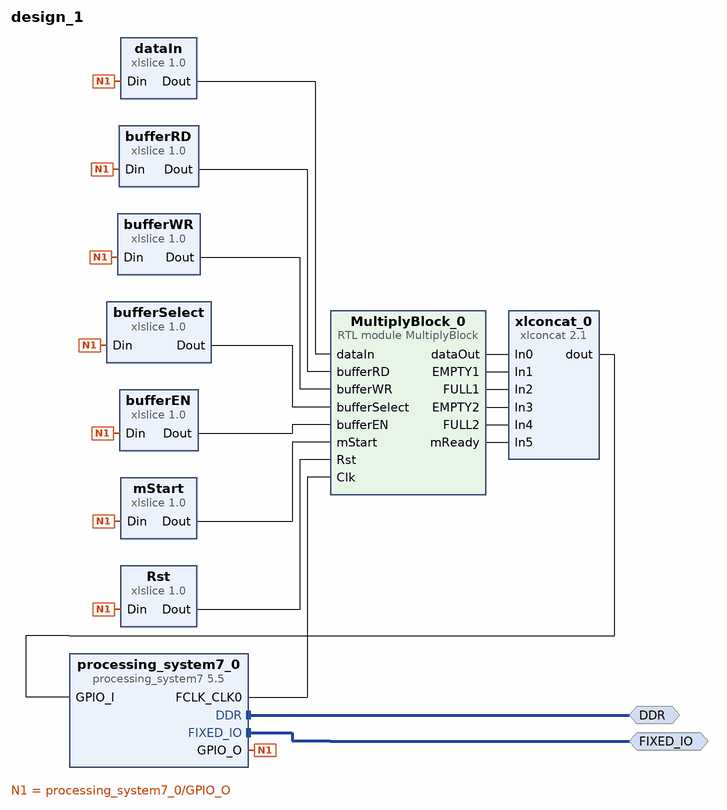
[diagram p0: block diagram of the top level]
# Vivado block design design_1, xc7z020clg400-1, Vivado 2019.2
create_bd_design design_1

create_bd_intf_port -mode Master -vlnv xilinx.com:interface:ddrx_rtl:1.0 DDR
create_bd_intf_port -mode Master -vlnv xilinx.com:display_processing_system7:fixedio_rtl:1.0 FIXED_IO

create_bd_cell -type module -reference MultiplyBlock MultiplyBlock_0
create_bd_cell -type ip -vlnv xilinx.com:ip:processing_system7:5.5 processing_system7_0
set_property -dict [list \
  CONFIG.PCW_APU_PERIPHERAL_FREQMHZ 650 \
  CONFIG.PCW_CRYSTAL_PERIPHERAL_FREQMHZ 50 \
  CONFIG.PCW_ENET0_ENET0_IO {MIO 16 .. 27} \
  CONFIG.PCW_ENET0_GRP_MDIO_ENABLE 1 \
  CONFIG.PCW_ENET0_GRP_MDIO_IO {MIO 52 .. 53} \
  CONFIG.PCW_ENET0_PERIPHERAL_ENABLE 1 \
  CONFIG.PCW_ENET0_RESET_ENABLE 1 \
  CONFIG.PCW_ENET0_RESET_IO {MIO 9} \
  CONFIG.PCW_ENET_RESET_ENABLE 1 \
  CONFIG.PCW_ENET_RESET_SELECT {Share reset pin} \
  CONFIG.PCW_FPGA0_PERIPHERAL_FREQMHZ 100 \
  CONFIG.PCW_FPGA1_PERIPHERAL_FREQMHZ 50 \
  CONFIG.PCW_GPIO_EMIO_GPIO_ENABLE 1 \
  CONFIG.PCW_GPIO_EMIO_GPIO_IO 64 \
  CONFIG.PCW_GPIO_MIO_GPIO_ENABLE 1 \
  CONFIG.PCW_GPIO_MIO_GPIO_IO MIO \
  CONFIG.PCW_I2C_RESET_ENABLE 0 \
  CONFIG.PCW_PERIPHERAL_BOARD_PRESET None \
  CONFIG.PCW_PRESET_BANK1_VOLTAGE {LVCMOS 1.8V} \
  CONFIG.PCW_QSPI_GRP_FBCLK_ENABLE 1 \
  CONFIG.PCW_QSPI_GRP_FBCLK_IO {MIO 8} \
  CONFIG.PCW_QSPI_GRP_SINGLE_SS_ENABLE 1 \
  CONFIG.PCW_QSPI_GRP_SINGLE_SS_IO {MIO 1 .. 6} \
  CONFIG.PCW_QSPI_PERIPHERAL_ENABLE 1 \
  CONFIG.PCW_QSPI_QSPI_IO {MIO 1 .. 6} \
  CONFIG.PCW_SD0_GRP_CD_ENABLE 1 \
  CONFIG.PCW_SD0_GRP_CD_IO {MIO 47} \
  CONFIG.PCW_SD0_GRP_WP_ENABLE 0 \
  CONFIG.PCW_SD0_PERIPHERAL_ENABLE 1 \
  CONFIG.PCW_SD0_SD0_IO {MIO 40 .. 45} \
  CONFIG.PCW_SDIO_PERIPHERAL_FREQMHZ 50 \
  CONFIG.PCW_SINGLE_QSPI_DATA_MODE x4 \
  CONFIG.PCW_UART0_PERIPHERAL_ENABLE 1 \
  CONFIG.PCW_UART0_UART0_IO {MIO 14 .. 15} \
  CONFIG.PCW_UART1_PERIPHERAL_ENABLE 0 \
  CONFIG.PCW_UART_PERIPHERAL_FREQMHZ 100 \
  CONFIG.PCW_UIPARAM_DDR_BUS_WIDTH {16 Bit} \
  CONFIG.PCW_UIPARAM_DDR_FREQ_MHZ 525 \
  CONFIG.PCW_UIPARAM_DDR_PARTNO {MT41J256M16 RE-125} \
  CONFIG.PCW_USB0_PERIPHERAL_ENABLE 1 \
  CONFIG.PCW_USB0_RESET_ENABLE 1 \
  CONFIG.PCW_USB0_RESET_IO {MIO 46} \
  CONFIG.PCW_USB0_USB0_IO {MIO 28 .. 39} \
  CONFIG.PCW_USB_RESET_ENABLE 1 \
  CONFIG.PCW_USB_RESET_SELECT {Share reset pin} \
  CONFIG.PCW_USE_M_AXI_GP0 0 \
] [get_bd_cells processing_system7_0]
# 476 more settings of processing_system7_0 are not shown: defaults, MIO pin electricals, DDR timing, and values the tool derives
create_bd_cell -type ip -vlnv xilinx.com:ip:xlslice:1.0 dataIn
set_property -dict {CONFIG.DIN_FROM 52 CONFIG.DIN_TO 37 CONFIG.DIN_WIDTH 64 CONFIG.DOUT_WIDTH 16} [get_bd_cells dataIn]
create_bd_cell -type ip -vlnv xilinx.com:ip:xlconcat:2.1 xlconcat_0
set_property -dict [list \
  CONFIG.IN0_WIDTH 32 \
  CONFIG.IN1_WIDTH 1 \
  CONFIG.IN2_WIDTH 1 \
  CONFIG.IN3_WIDTH 1 \
  CONFIG.IN4_WIDTH 1 \
  CONFIG.IN5_WIDTH 1 \
  CONFIG.NUM_PORTS 6 \
] [get_bd_cells xlconcat_0]
create_bd_cell -type ip -vlnv xilinx.com:ip:xlslice:1.0 bufferRD
set_property -dict {CONFIG.DIN_FROM 53 CONFIG.DIN_TO 53 CONFIG.DIN_WIDTH 64 CONFIG.DOUT_WIDTH 1} [get_bd_cells bufferRD]
create_bd_cell -type ip -vlnv xilinx.com:ip:xlslice:1.0 bufferWR
set_property -dict {CONFIG.DIN_FROM 54 CONFIG.DIN_TO 54 CONFIG.DIN_WIDTH 64 CONFIG.DOUT_WIDTH 1} [get_bd_cells bufferWR]
create_bd_cell -type ip -vlnv xilinx.com:ip:xlslice:1.0 bufferSelect
set_property -dict {CONFIG.DIN_FROM 55 CONFIG.DIN_TO 55 CONFIG.DIN_WIDTH 64 CONFIG.DOUT_WIDTH 1} [get_bd_cells bufferSelect]
create_bd_cell -type ip -vlnv xilinx.com:ip:xlslice:1.0 bufferEN
set_property -dict {CONFIG.DIN_FROM 56 CONFIG.DIN_TO 56 CONFIG.DIN_WIDTH 64 CONFIG.DOUT_WIDTH 1} [get_bd_cells bufferEN]
create_bd_cell -type ip -vlnv xilinx.com:ip:xlslice:1.0 mStart
set_property -dict {CONFIG.DIN_FROM 57 CONFIG.DIN_TO 57 CONFIG.DIN_WIDTH 64 CONFIG.DOUT_WIDTH 1} [get_bd_cells mStart]
create_bd_cell -type ip -vlnv xilinx.com:ip:xlslice:1.0 Rst
set_property -dict {CONFIG.DIN_FROM 58 CONFIG.DIN_TO 58 CONFIG.DIN_WIDTH 64 CONFIG.DOUT_WIDTH 1} [get_bd_cells Rst]

# ---- connections ----

connect_bd_intf_net [get_bd_intf_ports DDR] [get_bd_intf_pins processing_system7_0/DDR]
connect_bd_intf_net [get_bd_intf_ports FIXED_IO] [get_bd_intf_pins processing_system7_0/FIXED_IO]
connect_bd_net [get_bd_pins MultiplyBlock_0/dataOut] [get_bd_pins xlconcat_0/In0]
connect_bd_net [get_bd_pins MultiplyBlock_0/EMPTY1] [get_bd_pins xlconcat_0/In1]
connect_bd_net [get_bd_pins MultiplyBlock_0/FULL1] [get_bd_pins xlconcat_0/In2]
connect_bd_net [get_bd_pins MultiplyBlock_0/EMPTY2] [get_bd_pins xlconcat_0/In3]
connect_bd_net [get_bd_pins MultiplyBlock_0/FULL2] [get_bd_pins xlconcat_0/In4]
connect_bd_net [get_bd_pins processing_system7_0/GPIO_O] \
  [get_bd_pins dataIn/Din] [get_bd_pins bufferRD/Din] [get_bd_pins bufferWR/Din] [get_bd_pins bufferSelect/Din] \
  [get_bd_pins bufferEN/Din] [get_bd_pins mStart/Din] [get_bd_pins Rst/Din]
connect_bd_net [get_bd_pins xlconcat_0/dout] [get_bd_pins processing_system7_0/GPIO_I]
connect_bd_net -net xlslice_0_Dout [get_bd_pins dataIn/Dout] [get_bd_pins MultiplyBlock_0/dataIn]
connect_bd_net [get_bd_pins processing_system7_0/FCLK_CLK0] [get_bd_pins MultiplyBlock_0/Clk]
connect_bd_net [get_bd_pins MultiplyBlock_0/mReady] [get_bd_pins xlconcat_0/In5]
connect_bd_net [get_bd_pins bufferRD/Dout] [get_bd_pins MultiplyBlock_0/bufferRD]
connect_bd_net [get_bd_pins bufferWR/Dout] [get_bd_pins MultiplyBlock_0/bufferWR]
connect_bd_net [get_bd_pins bufferSelect/Dout] [get_bd_pins MultiplyBlock_0/bufferSelect]
connect_bd_net [get_bd_pins bufferEN/Dout] [get_bd_pins MultiplyBlock_0/bufferEN]
connect_bd_net [get_bd_pins mStart/Dout] [get_bd_pins MultiplyBlock_0/mStart]
connect_bd_net [get_bd_pins Rst/Dout] [get_bd_pins MultiplyBlock_0/Rst]

validate_bd_design
save_bd_design
